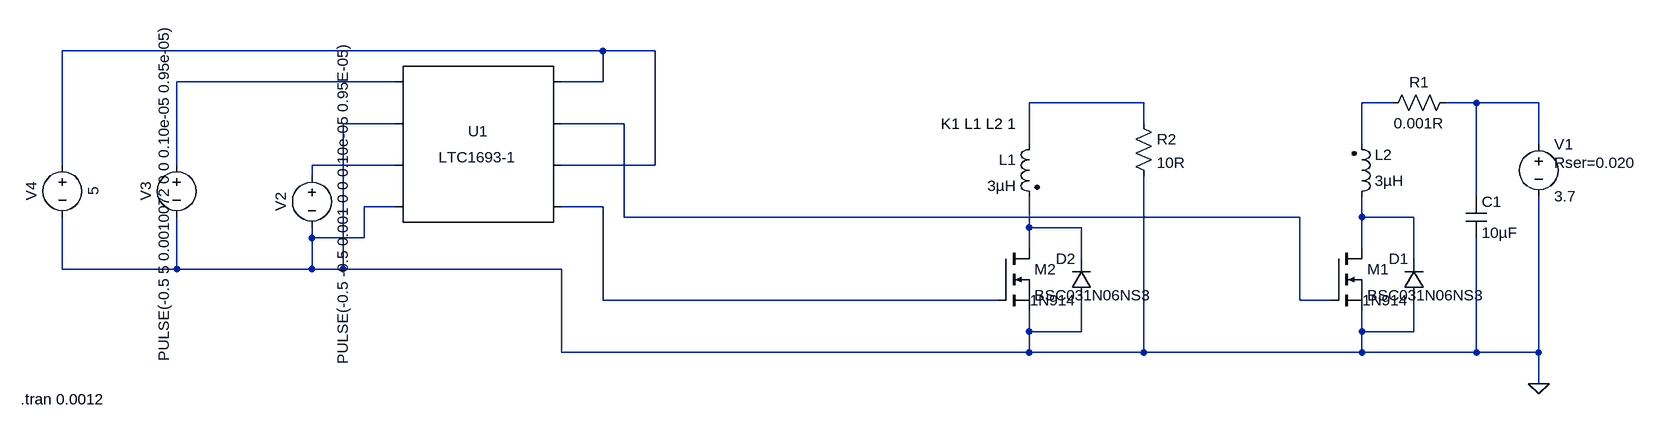
[diagram p0: schematic trafo_test.asc]
trafo_test.asc, the LTspice schematic file:
Version 4
SHEET 1 964 680
WIRE -784 -64 -1616 -64
WIRE -704 -64 -784 -64
WIRE -1104 -16 -1440 -16
WIRE -784 -16 -784 -64
WIRE -784 -16 -848 -16
WIRE 48 16 -128 16
WIRE 432 16 384 16
WIRE 560 16 512 16
WIRE 656 16 560 16
WIRE -1104 48 -1184 48
WIRE -752 48 -848 48
WIRE 48 48 48 16
WIRE -128 80 -128 16
WIRE 384 80 384 16
WIRE 656 80 656 16
WIRE -1616 112 -1616 -64
WIRE -1440 112 -1440 -16
WIRE -1104 112 -1232 112
WIRE -704 112 -704 -64
WIRE -704 112 -848 112
WIRE -1232 128 -1232 112
WIRE 560 160 560 16
WIRE -1104 176 -1152 176
WIRE -784 176 -848 176
WIRE -752 192 -752 48
WIRE 288 192 -752 192
WIRE 384 192 384 160
WIRE 464 192 384 192
WIRE -128 208 -128 160
WIRE -48 208 -128 208
WIRE -1232 224 -1232 208
WIRE -1152 224 -1152 176
WIRE -1152 224 -1232 224
WIRE -128 240 -128 208
WIRE 384 240 384 192
WIRE -48 256 -48 208
WIRE 464 256 464 192
WIRE -1616 272 -1616 192
WIRE -1440 272 -1440 192
WIRE -1440 272 -1616 272
WIRE -1232 272 -1232 224
WIRE -1232 272 -1440 272
WIRE -1184 272 -1184 48
WIRE -1184 272 -1232 272
WIRE -848 272 -1184 272
WIRE -784 320 -784 176
WIRE -176 320 -784 320
WIRE 288 320 288 192
WIRE 336 320 288 320
WIRE -128 368 -128 336
WIRE -48 368 -48 320
WIRE -48 368 -128 368
WIRE 384 368 384 336
WIRE 464 368 464 320
WIRE 464 368 384 368
WIRE -848 400 -848 272
WIRE -128 400 -128 368
WIRE -128 400 -848 400
WIRE 48 400 48 128
WIRE 48 400 -128 400
WIRE 384 400 384 368
WIRE 384 400 48 400
WIRE 560 400 560 224
WIRE 560 400 384 400
WIRE 656 400 656 160
WIRE 656 400 560 400
WIRE 656 448 656 400
FLAG 656 448 0
SYMBOL voltage 656 64 R0
WINDOW 123 0 0 Left 2
WINDOW 39 24 44 Left 2
SYMATTR SpiceLine Rser=0.020
SYMATTR InstName V1
SYMATTR Value 3.7
SYMBOL ind2 -112 64 M0
SYMATTR InstName L1
SYMATTR Value 3µH
SYMATTR Type ind
SYMATTR SpiceLine Ipk=3,3 Rser=0.01
SYMBOL ind2 368 176 M180
WINDOW 0 36 80 Left 2
WINDOW 3 36 40 Left 2
SYMATTR InstName L2
SYMATTR Value 3µH
SYMATTR Type ind
SYMATTR SpiceLine Ipk=3,3 Rser=0.01
SYMBOL nmos 336 240 R0
SYMATTR InstName M1
SYMATTR Value BSC031N06NS3
SYMBOL diode 480 320 R180
WINDOW 0 24 64 Left 2
WINDOW 3 24 0 Left 2
SYMATTR InstName D1
SYMATTR Value 1N914
SYMATTR Description Schottky diode
SYMATTR Type schottky
SYMBOL nmos -176 240 R0
SYMATTR InstName M2
SYMATTR Value BSC031N06NS3
SYMBOL diode -32 320 R180
WINDOW 0 24 64 Left 2
WINDOW 3 24 0 Left 2
SYMATTR InstName D2
SYMATTR Value 1N914
SYMATTR Description Schottky diode
SYMATTR Type schottky
SYMBOL cap 544 160 R0
SYMATTR InstName C1
SYMATTR Value 10µF
SYMBOL voltage -1232 112 R0
WINDOW 0 -32 56 VBottom 2
WINDOW 3 32 56 VTop 2
WINDOW 123 0 0 Left 2
WINDOW 39 0 0 Left 2
SYMATTR InstName V2
SYMATTR Value PULSE(-0.5 -0.5 0.001 0 0 0.10e-05 0.95E-05)
SYMBOL voltage -1440 96 R0
WINDOW 0 -32 56 VBottom 2
WINDOW 3 -4 56 VBottom 2
WINDOW 123 0 0 Left 2
WINDOW 39 0 0 Left 2
SYMATTR InstName V3
SYMATTR Value PULSE(-0.5 5 0.0010072 0 0 0.10e-05 0.95e-05)
SYMBOL PowerProducts\\LTC1693-1 -976 80 R0
SYMATTR InstName U1
SYMBOL res 528 0 R90
WINDOW 0 0 56 VBottom 2
WINDOW 3 32 56 VTop 2
SYMATTR InstName R1
SYMATTR Value 0.001R
SYMBOL voltage -1616 96 R0
WINDOW 0 -32 56 VBottom 2
WINDOW 3 32 56 VTop 2
WINDOW 123 0 0 Left 2
WINDOW 39 0 0 Left 2
SYMATTR InstName V4
SYMATTR Value 5
SYMBOL res 32 32 R0
SYMATTR InstName R2
SYMATTR Value 10R
TEXT -264 48 Left 2 !K1 L1 L2 1
TEXT -1680 472 Left 2 !.tran 0.0012

The netlist it stands for:
* trafo_test.asc
V1 N005 0 3.7 Rser=0.020
L1 N003 N010 3µH Ipk=3,3 Rser=0.01
L2 N009 N004 3µH Ipk=3,3 Rser=0.01
M1 N009 N006 0 0 BSC031N06NS3
D1 0 N009 1N914
M2 N010 N008 0 0 BSC031N06NS3
D2 0 N010 1N914
C1 N005 0 10µF
V2 N007 0 PULSE(-0.5 -0.5 0.001 0 0 0.10e-05 0.95E-05)
V3 N002 0 PULSE(-0.5 5 0.0010072 0 0 0.10e-05 0.95e-05)
XU1 N002 0 N007 0 N008 N001 N006 N001 LTC1693-1
R1 N005 N004 0.001R
V4 N001 0 5
R2 N003 0 10R
.model D D
.lib standard.dio
.model NMOS NMOS
.model PMOS PMOS
.lib standard.mos
K1 L1 L2 1
.tran 0.0012
.lib LTC1693-1.sub
.backanno
.end